# EAGLE design ATtiny_45_and_85_programmer_shield (EAGLE 5.11)
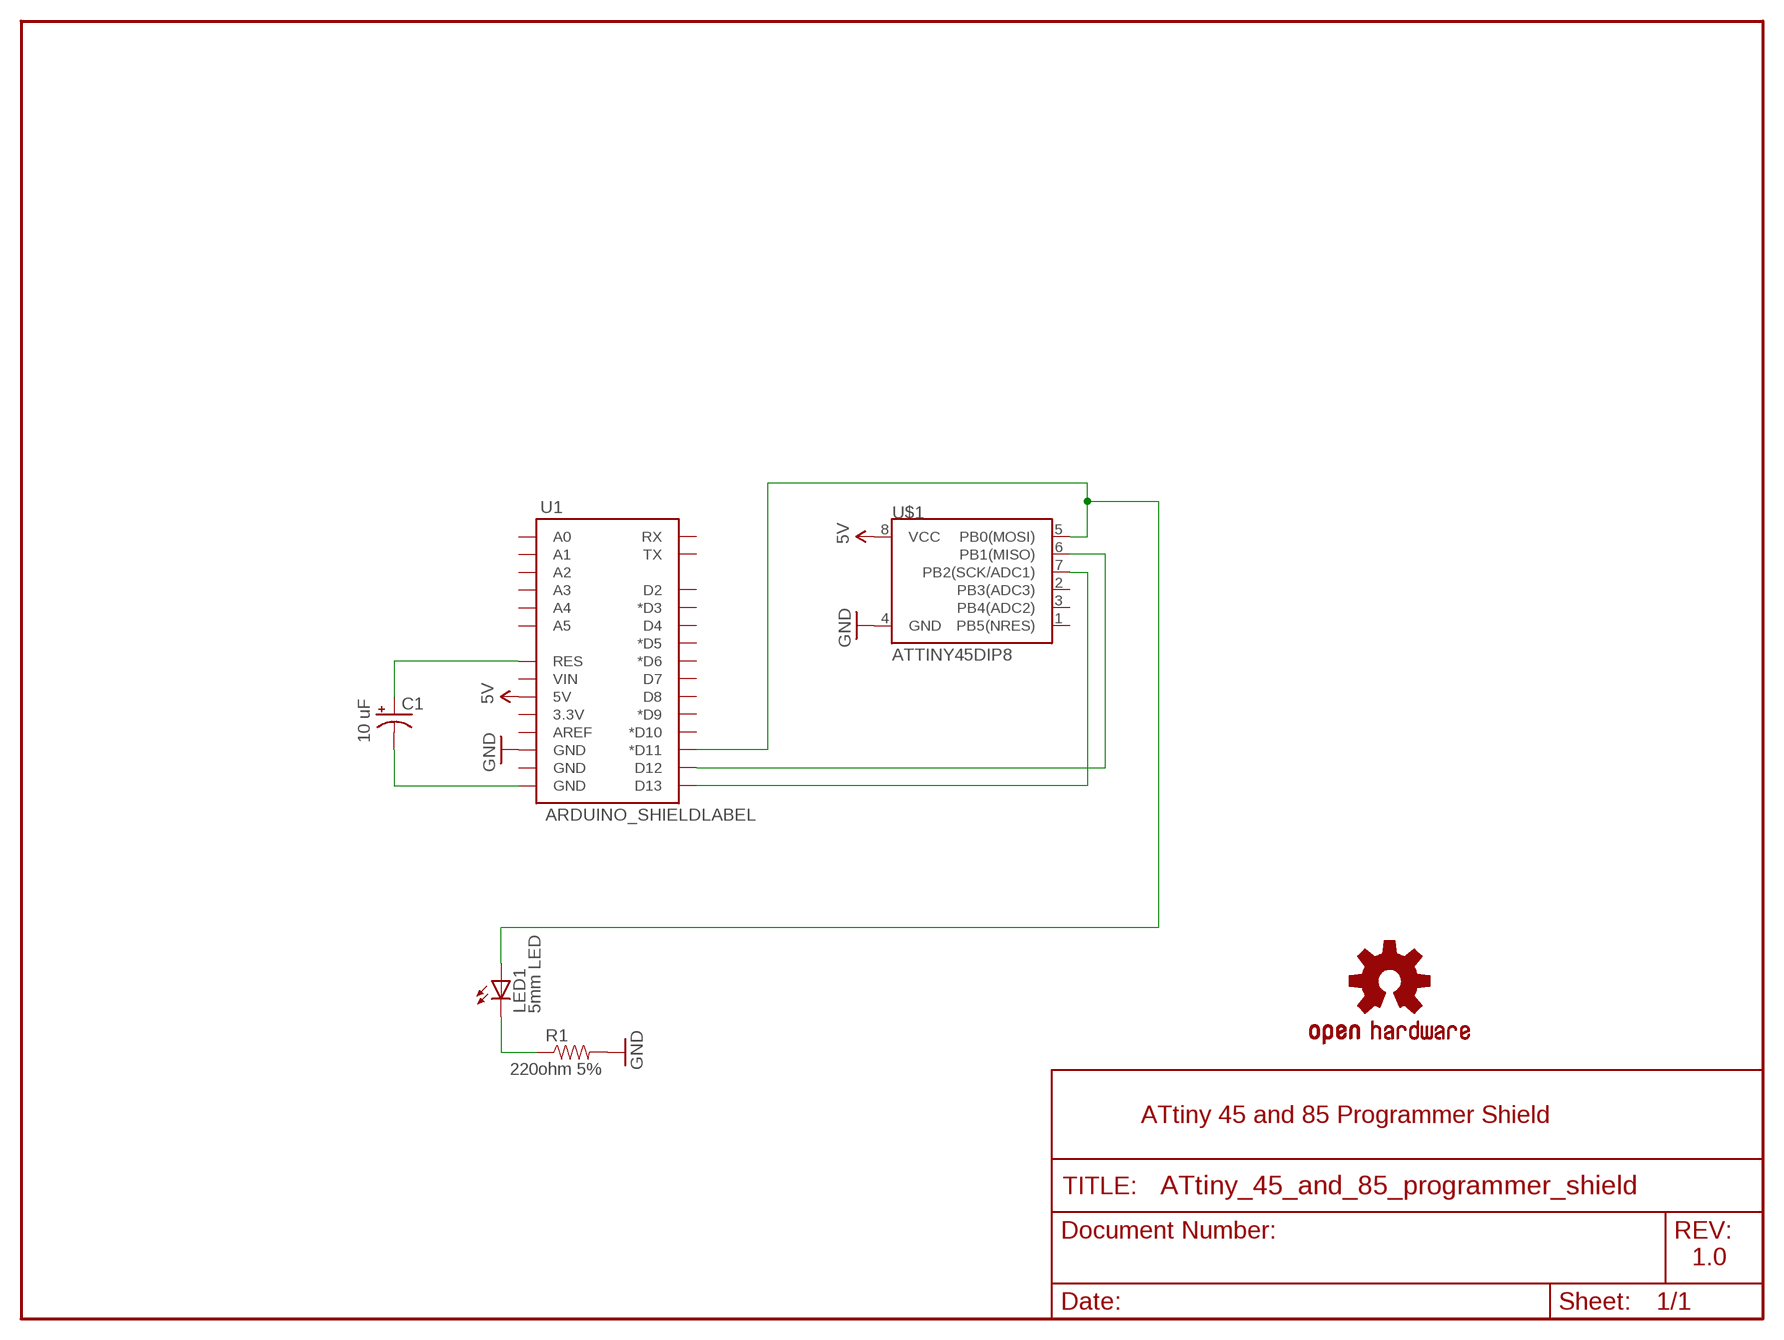
[diagram p0: schematic, sheet 1]

## Parts
C1  10 uF  CAP_POLPTH2  [CPOL-RADIAL-10UF-25V]
LED1  5mm LED  LED5MM  [LED5MM]
R1  220ohm 5%  RESISTORPTH-1/4W  [AXIAL-0.4]
U1  ARDUINO_SHIELDLABEL  [DUEMILANOVE_SHIELD]
U$1  ATTINY45DIP8  [DIP08]
U$4  OSHW-LOGOL  [OSHW-LOGO-L]

## Nets
5V: U1.5V U$1.8(VCC)
GND: R1.P$2 U1.GND@2(GND) U$1.4(GND)
N$1: LED1.A U1.D11(*D11) U$1.5(PB0(MOSI))
N$2: U1.D12 U$1.6(PB1(MISO))
N$3: U1.D13 U$1.7(PB2(SCK/ADC1))
N$4: C1.2(-) U1.GND@0(GND)
N$5: C1.1(+) U1.RES
N$7: LED1.K(C) R1.P$1
Unconnected: U1.3.3V U1.A0 U1.A1 U1.A2 U1.A3 U1.A4 U1.A5 U1.AREF U1.D2 U1.D3(*D3) U1.D4 U1.D5(*D5) U1.D6(*D6) U1.D7 U1.D8 U1.D9(*D9) U1.D10(*D10) U1.GND@1(GND) U1.RX U1.TX U1.VIN U$1.1(PB5(NRES)) U$1.2(PB3(ADC3)) U$1.3(PB4(ADC2))

## Notes on the sheet
- ATtiny 45 and 85 Programmer Shield
- 1.0

## Library data of the parts
C1 = SparkFun:CAP_POL: Capacitor Polarized These are standard SMD and PTH capacitors. Normally 10uF, 47uF, and 100uF in electrolytic and tantalum varieties. Always verify the external diameter of the through hole cap, it varies with capacity, voltage, and manufacturer. The EIA devices should be standard.
LED1 = SparkFun:LED: LEDs Standard schematic elements and footprints for 5mm, 3mm, 1206, and 0603 sized LEDs. 5mm - Spark Fun Electronics SKU : COM-00529 (and others)
R1 = SparkFun:RESISTOR: Resistor Basic schematic elements and footprints for 0603, 1206, and PTH resistors.
U1 = SparkFun:ARDUINO_SHIELD
U$1 = SparkFun:ATTINY45: Atmel ATTiny45
U$4 = SparkFun:OSHW-LOGO: Open Source Hardware Logo This logo indicates the piece of hardware it is found on incorporates a OSHW license and/or adheres to the definition of open source hardware found here: http://freedomdefined.org/OSHW

## Board
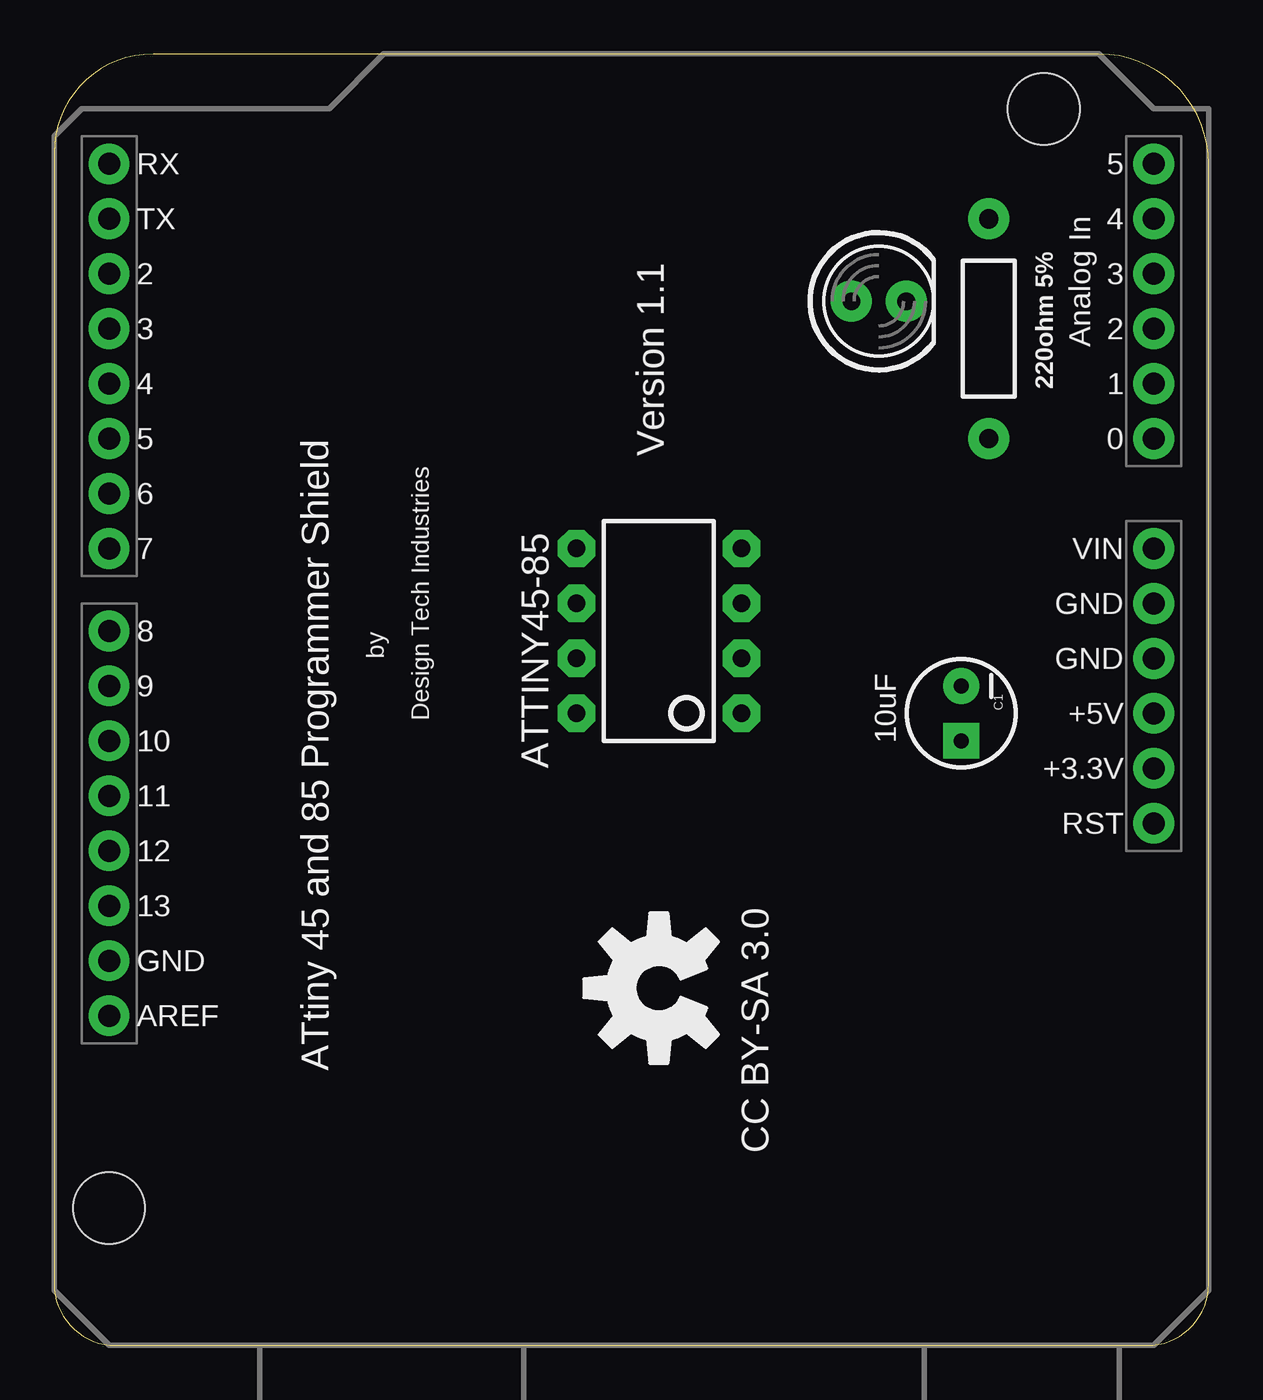
[diagram p1: board, top side]
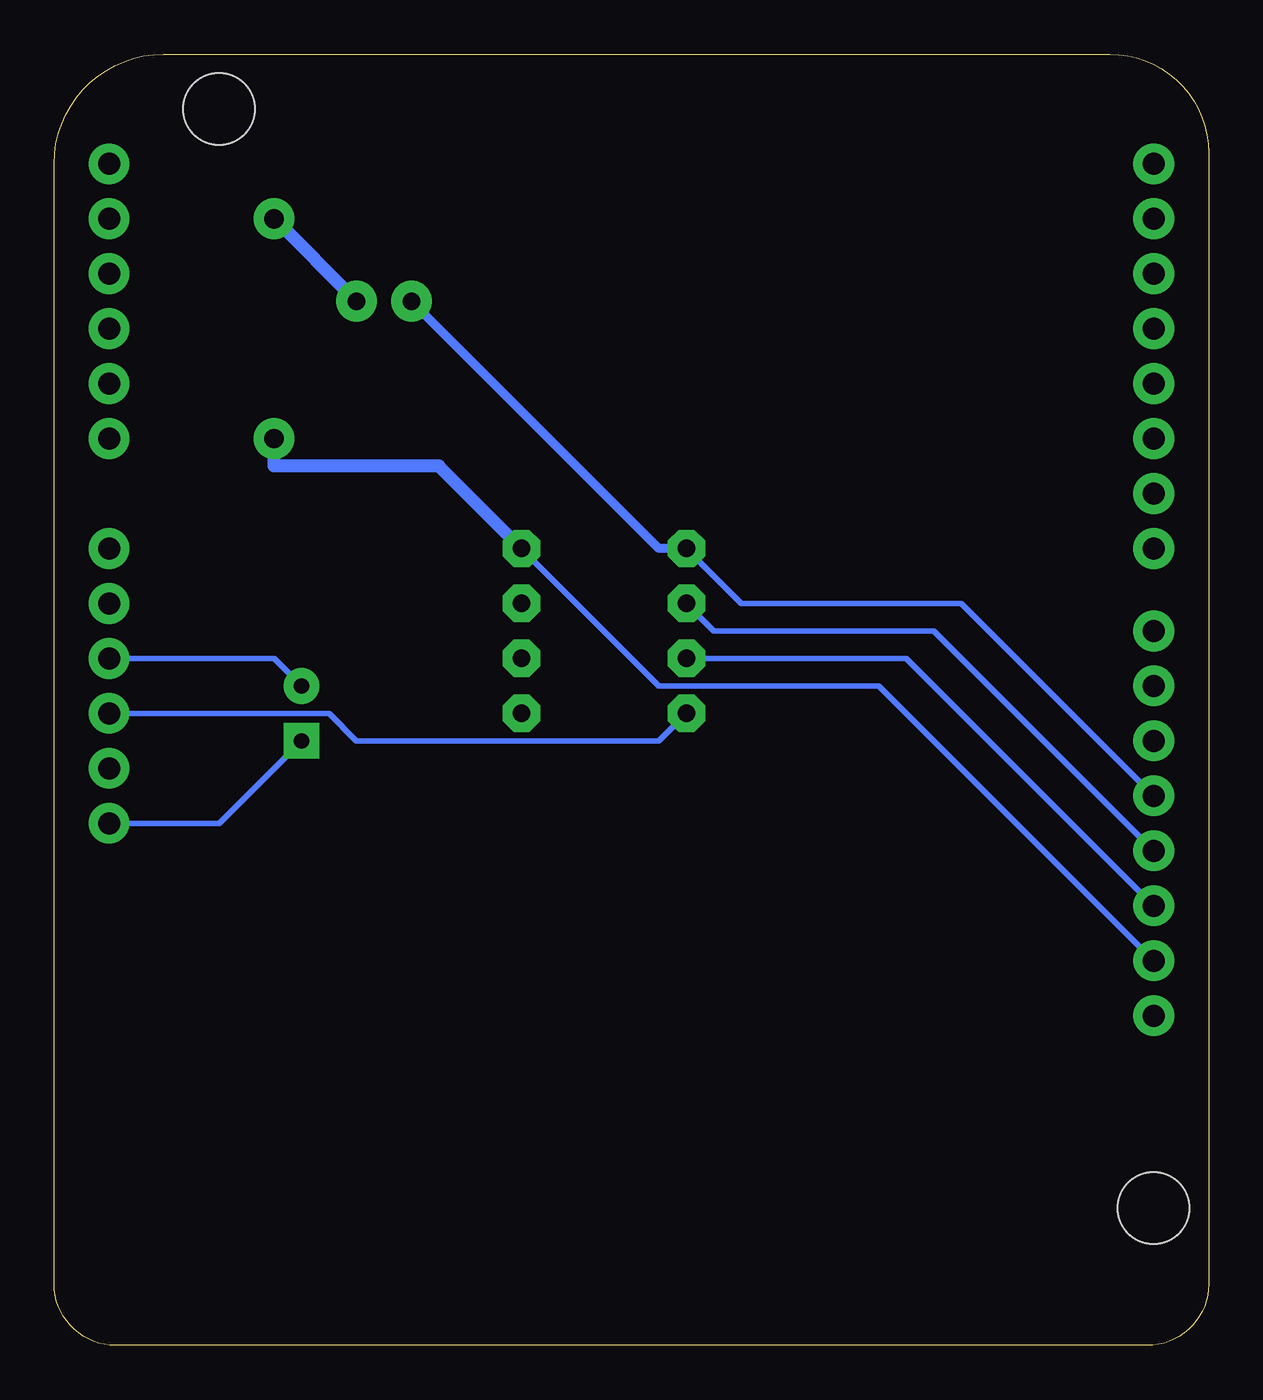
[diagram p2: board, bottom side, seen from below]

Size 53.34 x 59.68 mm. Coordinates in mm from the lower left corner, seen from the top.
Outline: 53.34,2.84 53.34,54.61 arc90 48.27,59.68 4.57,59.68 arc90 0,55.11 0,2.84 arc90 2.84,0 50.5,0 arc90 53.34,2.84
Copper layers (1*16): Top 0.035mm / dielectric 1.5mm / Bottom 0.035mm
Design rules "SparkFun": minimum track width 8mil, minimum drill 20mil, track to track 8mil, track to pad 8mil, pad to pad 8mil, via to via 8mil, smd to smd 8mil, copper to edge 10mil, drill to drill 8mil, minimum pad ring 12mil, minimum via ring 10mil, stop-mask expansion 4mil, vias tented up to drill 25mil, thermal gap 10mil

### Footprints (pad centres in the part's own frame; a part is rotated, then mirrored left to right if it is on the bottom)
CPOL-RADIAL-10UF-25V = drill 0.7 pad 1.651 square: 1 1.27,0 | drill 0.7 pad 1.651 round: 2 -1.27,0
LED5MM = drill 0.813 pad 1.88 round: A -1.27,0; K 1.27,0
AXIAL-0.4 = drill 0.9 pad 1.88 round: P$1 -5.08,0; P$2 5.08,0
DUEMILANOVE_SHIELD = drill 1.016 pad 1.88 round: 3.3V 50.8,26.67; 5V 50.8,29.21; A0 50.8,41.91; A1 50.8,44.45; A2 50.8,46.99; A3 50.8,49.53; A4 50.8,52.07; A5 50.8,54.61; AREF 2.54,15.24; D2 2.54,49.53; D3 2.54,46.99; D4 2.54,44.45; D5 2.54,41.91; D6 2.54,39.37; D7 2.54,36.83; D8 2.54,33.02; D9 2.54,30.48; D10 2.54,27.94; D11 2.54,25.4; D12 2.54,22.86; D13 2.54,20.32; GND@0 50.8,31.75; GND@1 50.8,34.29; GND@2 2.54,17.78; RES 50.8,24.13; RX 2.54,54.61; TX 2.54,52.07; VIN 50.8,36.83 | hole 3.302: 45.72,57.15; 2.54,6.35
DIP08 = drill 0.813 pad 1.727 octagon: 1 -3.81,-3.81; 2 -1.27,-3.81; 3 1.27,-3.81; 4 3.81,-3.81; 5 3.81,3.81; 6 1.27,3.81; 7 -1.27,3.81; 8 -3.81,3.81

### Placement (x,y rotation side)
C1  41.91,29.21 270 top
LED1  38.1,48.26 0 top
R1  43.18,46.99 270 top
U1  0,0 0 top
U$1  27.94,33.02 90 top
U$4  27.94,16.51 90 top

### Tracks (layer width: path | path; a pad name or v marks a point on that pad's centre or on a via)
5V
  Bottom 0.254: U$1.8 25.4,27.94 39.37,27.94 40.64,29.21 U1.5V
GND
  Bottom 0.254: U$1.4 25.4,30.48 15.24,30.48 U1.GND@2
  Bottom 0.61: U$1.4 35.56,40.64 43.18,40.64 R1.P$2
N$1
  Bottom 0.254: U$1.5 21.59,34.29 11.43,34.29 U1.D11
  Bottom 0.406: U$1.5 25.4,36.83 LED1.A
N$2
  Bottom 0.254: U$1.6 22.86,33.02 12.7,33.02 U1.D12
N$3
  Bottom 0.254: U$1.7 13.97,31.75 U1.D13
N$4
  Bottom 0.254: C1.2 43.18,31.75 U1.GND@0
N$5
  Bottom 0.254: C1.1 45.72,24.13 U1.RES
N$7
  Bottom 0.61: LED1.K R1.P$1

### Text on the board
tPlace: Design Tech Industries | Version 1.1 | by | 10uF | ATTINY45-85 | ATtiny 45 and 85 Programmer Shield | CC BY-SA 3.0